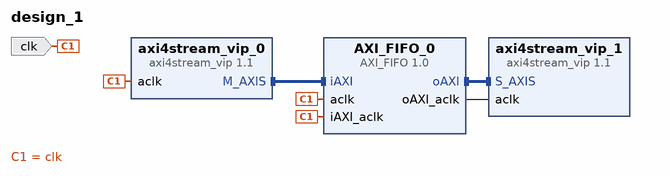
[diagram p0: block diagram of the top level]
# Vivado block design design_1, xc7z020clg484-1, Vivado 2019.1
create_bd_design design_1

create_bd_port -dir I -type clk clk
set_property -dict {CONFIG.FREQ_HZ 200000} [get_bd_ports clk]

create_bd_cell -type ip -vlnv xilinx.com:ip:axi4stream_vip:1.1 axi4stream_vip_0
set_property -dict [list \
  CONFIG.HAS_ARESETN 0 \
  CONFIG.HAS_TKEEP 0 \
  CONFIG.HAS_TLAST 0 \
  CONFIG.HAS_TREADY 1 \
  CONFIG.HAS_TSTRB 0 \
  CONFIG.INTERFACE_MODE MASTER \
  CONFIG.TDATA_NUM_BYTES 2 \
  CONFIG.TDEST_WIDTH 0 \
  CONFIG.TID_WIDTH 0 \
  CONFIG.TUSER_WIDTH 0 \
] [get_bd_cells axi4stream_vip_0]
create_bd_cell -type ip -vlnv xilinx.com:ip:axi4stream_vip:1.1 axi4stream_vip_1
set_property -dict {CONFIG.HAS_ARESETN 0 CONFIG.INTERFACE_MODE SLAVE} [get_bd_cells axi4stream_vip_1]
create_bd_cell -type ip -vlnv xilinx.com:user:AXI_FIFO:1.0 AXI_FIFO_0

# ---- connections ----

connect_bd_intf_net [get_bd_intf_pins AXI_FIFO_0/oAXI] [get_bd_intf_pins axi4stream_vip_1/S_AXIS]
connect_bd_intf_net [get_bd_intf_pins axi4stream_vip_0/M_AXIS] [get_bd_intf_pins AXI_FIFO_0/iAXI]
connect_bd_net -net clk_wiz_clk_out1 [get_bd_ports clk] \
  [get_bd_pins axi4stream_vip_0/aclk] [get_bd_pins AXI_FIFO_0/aclk] [get_bd_pins AXI_FIFO_0/iAXI_aclk]
connect_bd_net [get_bd_pins AXI_FIFO_0/oAXI_aclk] [get_bd_pins axi4stream_vip_1/aclk]

validate_bd_design
save_bd_design
